# Altium schematic sheet Sheet2.SchDoc
size A
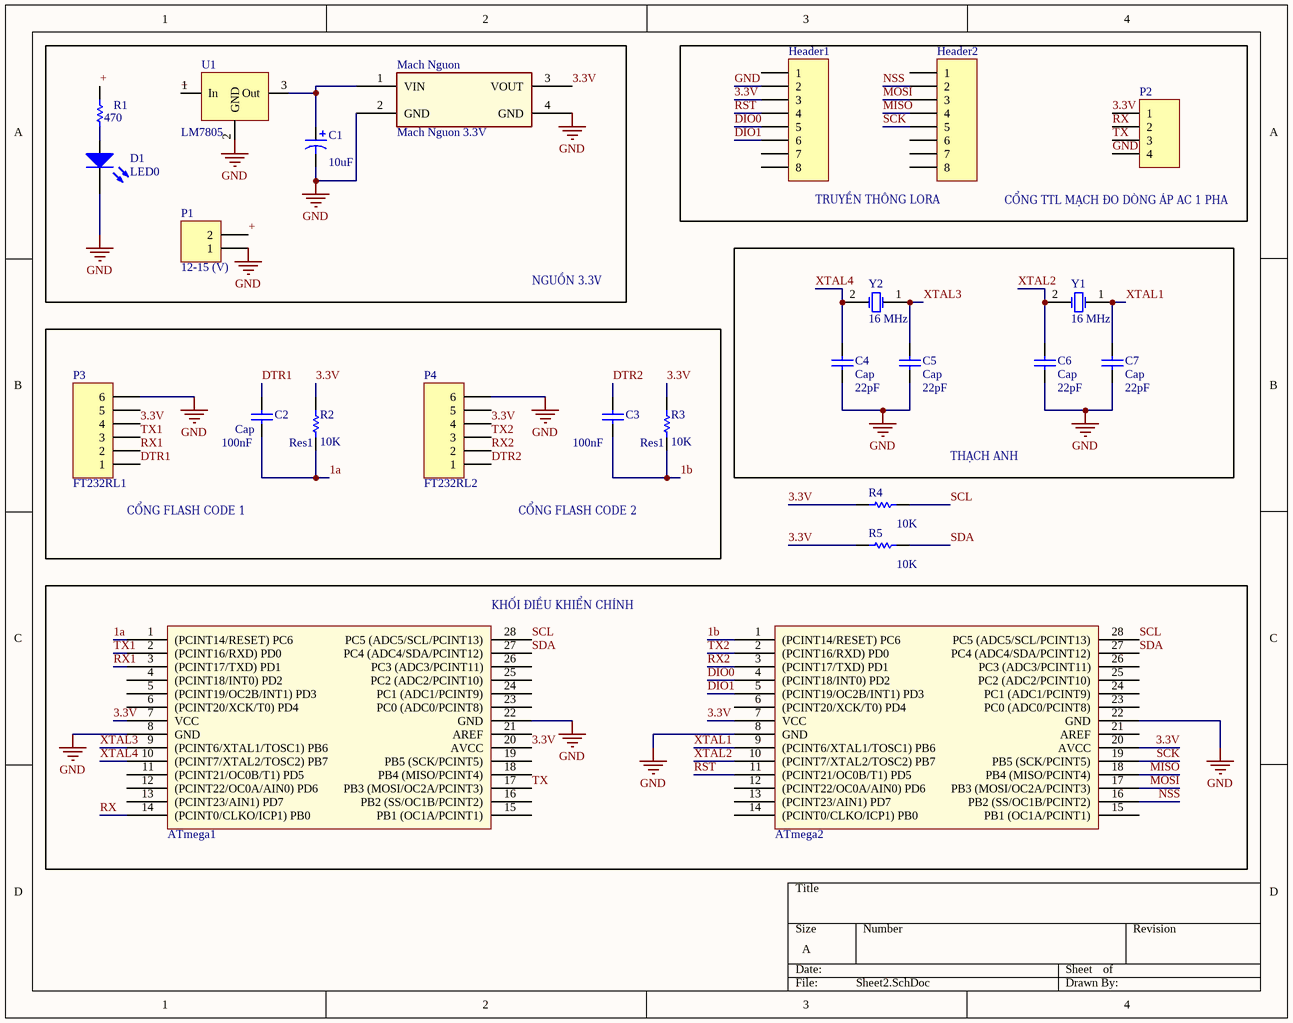
[diagram p0: Sheet2.SchDoc]

## Parts
ATmega1  ATmega328P  [DIP794W46P254L2967H457Q28B]  (value not drawn)
ATmega2  ATmega328P  [DIP794W46P254L2967H457Q28B]  (value not drawn)
C1  value 10uF  [RB7.6-15]  (hidden comment: Cap Pol1)
C2  Cap  value 100nF  [RAD-0.3]
C3  value 100nF  [RAD-0.3]  (hidden comment: Cap3)
C4  Cap  value 22pF  [RAD-0.3]
C5  Cap  value 22pF  [RAD-0.3]
C6  Cap  value 22pF  [RAD-0.3]
C7  Cap  value 22pF  [RAD-0.3]
D1  LED0  [LED-0]
Header1  (no value)  [HDR1X8]
Header2  (no value)  [HDR1X8]
Mach_Nguon  Mach Nguon 3.3V  [PCBComponent_1]
P1  12-15 (V)  [HDR1X2]
P2  Header 4  [HDR1X4]  (value not drawn)
P3  FT232RL1  [HDR1X6]
P4  FT232RL2  [HDR1X6]
R1  value 470  [AXIAL-0.3]  (hidden comment: Res1)
R2  Res1  value 10K  [AXIAL-0.3]
R3  Res1  value 10K  [AXIAL-0.3]
R4  value 10K  [AXIAL-0.3]  (hidden comment: Res1)
R5  value 10K  [AXIAL-0.3]  (hidden comment: Res1)
U1  LM7805  [TO92-]
Y1  16 MHz  [R38]
Y2  16 MHz  [R38]

## Blocks framed on the sheet
NGUỒN 3.3V: C1 D1 Mach_Nguon P1 R1 U1
THẠCH ANH: C4-C7 Y1 Y2
KHỐI ĐIỀU KHIỂN CHÍNH: ATmega1 ATmega2

## Nets
GND: ATmega1.8(GND) ATmega1.22(GND) ATmega2.8(GND) ATmega2.22(GND) C1.2 C4.1 C5.1 C6.1 C7.1 D1.2(K) Header1.2 Mach_Nguon.2(GND) Mach_Nguon.4(GND) P1.1 P2.4 P3.6 P4.6 U1.2(GND)
1a: ATmega1.1((PCINT14/RESET)_PC6) C2.1 R2.1
1b: ATmega2.1((PCINT14/RESET)_PC6) C3.1 R3.1
3.3V: ATmega1.7(VCC) ATmega1.20(AVCC) ATmega2.7(VCC) ATmega2.20(AVCC) Header1.3 Mach_Nguon.3(VOUT) P2.1 P3.4 P4.4 R2.2 R3.2 R4.1 R5.1
+: P1.2 R1.2 U1.1(In)
DIO0: ATmega2.4((PCINT18/INT0)_PD2) Header1.5
DIO1: ATmega2.5((PCINT19/OC2B/INT1)_PD3) Header1.6
DTR1: C2.2 P3.1
DTR2: C3.2 P4.1
MISO: ATmega2.18(PB4_(MISO/PCINT4)) Header2.4
MOSI: ATmega2.17(PB3_(MOSI/OC2A/PCINT3)) Header2.3
NSS: ATmega2.16(PB2_(SS/OC1B/PCINT2)) Header2.2
RST: ATmega2.11((PCINT21/OC0B/T1)_PD5) Header1.4
RX: ATmega1.14((PCINT0/CLKO/ICP1)_PB0) P2.2
RX1: ATmega1.3((PCINT17/TXD)_PD1) P3.2
RX2: ATmega2.3((PCINT17/TXD)_PD1) P4.2
SCK: ATmega2.19(PB5_(SCK/PCINT5)) Header2.5
SCL: ATmega1.28(PC5_(ADC5/SCL/PCINT13)) ATmega2.28(PC5_(ADC5/SCL/PCINT13)) R4.2
SDA: ATmega1.27(PC4_(ADC4/SDA/PCINT12)) ATmega2.27(PC4_(ADC4/SDA/PCINT12)) R5.2
TX: ATmega1.17(PB3_(MOSI/OC2A/PCINT3)) P2.3
TX1: ATmega1.2((PCINT16/RXD)_PD0) P3.3
TX2: ATmega2.2((PCINT16/RXD)_PD0) P4.3
XTAL1: ATmega2.9((PCINT6/XTAL1/TOSC1)_PB6) C7.2 Y1.1(OSC1)
XTAL2: ATmega2.10((PCINT7/XTAL2/TOSC2)_PB7) C6.2 Y1.2(OSC2)
XTAL3: ATmega1.9((PCINT6/XTAL1/TOSC1)_PB6) C5.2 Y2.1(OSC1)
XTAL4: ATmega1.10((PCINT7/XTAL2/TOSC2)_PB7) C4.2 Y2.2(OSC2)
NetC1_1: C1.1 Mach_Nguon.1(VIN) U1.3(Out)
NetD1_1: D1.1(A) R1.1

Not connected (* = marked no-connect by the designer): ATmega1 4((PCINT18/INT0)_PD2) 5((PCINT19/OC2B/INT1)_PD3) 6((PCINT20/XCK/T0)_PD4) 11((PCINT21/OC0B/T1)_PD5) 12((PCINT22/OC0A/AIN0)_PD6) 13((PCINT23/AIN1)_PD7) 15(PB1_(OC1A/PCINT1)) 16(PB2_(SS/OC1B/PCINT2)) 18(PB4_(MISO/PCINT4)) 19(PB5_(SCK/PCINT5)) 21(AREF) 23(PC0_(ADC0/PCINT8)) 24(PC1_(ADC1/PCINT9)) 25(PC2_(ADC2/PCINT10)) 26(PC3_(ADC3/PCINT11)); ATmega2 6((PCINT20/XCK/T0)_PD4) 12((PCINT22/OC0A/AIN0)_PD6) 13((PCINT23/AIN1)_PD7) 14((PCINT0/CLKO/ICP1)_PB0) 15(PB1_(OC1A/PCINT1)) 21(AREF) 23(PC0_(ADC0/PCINT8)) 24(PC1_(ADC1/PCINT9)) 25(PC2_(ADC2/PCINT10)) 26(PC3_(ADC3/PCINT11)); Header1 1 7 8; Header2 1 6 7 8; P3 5; P4 5

## Notes on the sheet
- TRUYỀN THÔNG LORA
- (near P2) CỔNG TTL MẠCH ĐO DÒNG ÁP AC 1 PHA
- (near P3) CỔNG FLASH CODE 1
- CỔNG FLASH CODE 2

## Library data of the parts
C1 = Cap Pol1: Polarized Capacitor (Radial); Published: 8-Jun-2000; LatestRevisionDate: 17-Jul-2002; LatestRevisionNote: Re-released for DXP Platform.; PackageReference: RB7.6-15; Publisher: Altium Limited; PackageDescription: Polarized Capacitor (Radial); 2 Leads
C2-C7 = Cap: Capacitor; Published: 8-Jun-2000; LatestRevisionDate: 17-Jul-2002; LatestRevisionNote: Re-released for DXP Platform.; PackageReference: RAD-0.3; Publisher: Altium Limited; PackageDescription: Radial Cap, Thru-Hole; 2 Leads; 0.3 in Pin Spacing
D1 = LED0: Typical INFRARED GaAs LED; Published: 8-Jun-2000; LatestRevisionDate: 08-Jul-2005; LatestRevisionNote: Mech Layer 1 removed.; PackageReference: LED-0; Publisher: Altium Limited; PackageDescription: LED; 2 Leads
Header1 Header2 = Header 8: Header, 8-Pin; LatestRevisionDate: 17-Jul-2002; LatestRevisionNote: Re-released for DXP Platform.; Publisher: Altium Limited
Mach_Nguon = Component_1
P1 = Header 2: Header, 2-Pin; LatestRevisionDate: 17-Jul-2002; LatestRevisionNote: Re-released for DXP Platform.; Publisher: Altium Limited
P2 = Header 4: Header, 4-Pin; LatestRevisionDate: 17-Jul-2002; LatestRevisionNote: Re-released for DXP Platform.; Publisher: Altium Limited
P3 P4 = Header 6: Header, 6-Pin; LatestRevisionDate: 17-Jul-2002; LatestRevisionNote: Re-released for DXP Platform.; Publisher: Altium Limited
R1-R5 = Res1: Resistor; Published: 8-Jun-2000; LatestRevisionDate: 17-Jul-2002; LatestRevisionNote: Re-released for DXP Platform.; PackageReference: AXIAL-0.3; Publisher: Altium Limited; PackageDescription: Axial Device, Thru-Hole; 2 Leads; 0.3 in Pin Spacing
U1 = LM7805: IC REG LIN 5V 1A
Y1 Y2 = XTAL: Crystal Oscillator; Published: 8-Jun-2000; LatestRevisionDate: 17-Jul-2002; LatestRevisionNote: Re-released for DXP Platform.; PackageReference: R38; Publisher: Altium Limited; PackageDescription: Crystal, Thru-Hole; 2 Leads; Body 3.1 x 8.2 mm (Dia.xH)